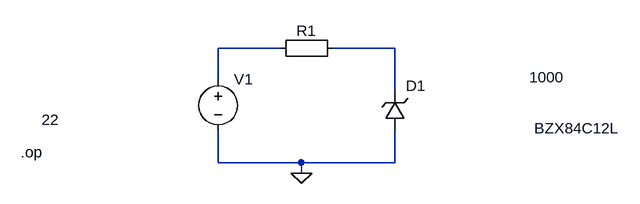
[diagram p0: schematic zener_current_1.asc]
zener_current_1.asc, the LTspice schematic file:
Version 4
SHEET 1 880 680
WIRE 112 -272 16 -272
WIRE 288 -272 192 -272
WIRE 16 -224 16 -272
WIRE 288 -208 288 -272
WIRE 16 -96 16 -144
WIRE 144 -96 16 -96
WIRE 288 -96 288 -144
WIRE 288 -96 144 -96
WIRE 144 -80 144 -96
FLAG 144 -80 0
SYMBOL Misc\\EuropeanResistor 208 -288 R90
WINDOW 0 5 56 VBottom 2
WINDOW 3 45 -314 VTop 2
SYMATTR InstName R1
SYMATTR Value 1000
SYMBOL zener 304 -144 R180
WINDOW 0 -32 70 Left 2
WINDOW 3 -330 5 Left 2
SYMATTR InstName D1
SYMATTR Value BZX84C12L
SYMBOL voltage 16 -240 R0
WINDOW 3 -272 78 Left 2
SYMATTR InstName V1
SYMATTR Value 22
TEXT -288 -112 Left 2 !.op

The netlist it stands for:
* zener_current_1.asc
R1 N002 N001 1000
D1 0 N002 BZX84C12L
V1 N001 0 22
.model D D
.lib standard.dio
.op
.backanno
.end